# EAGLE design Adafruit Motor Shield v2 (EAGLE 6.3)
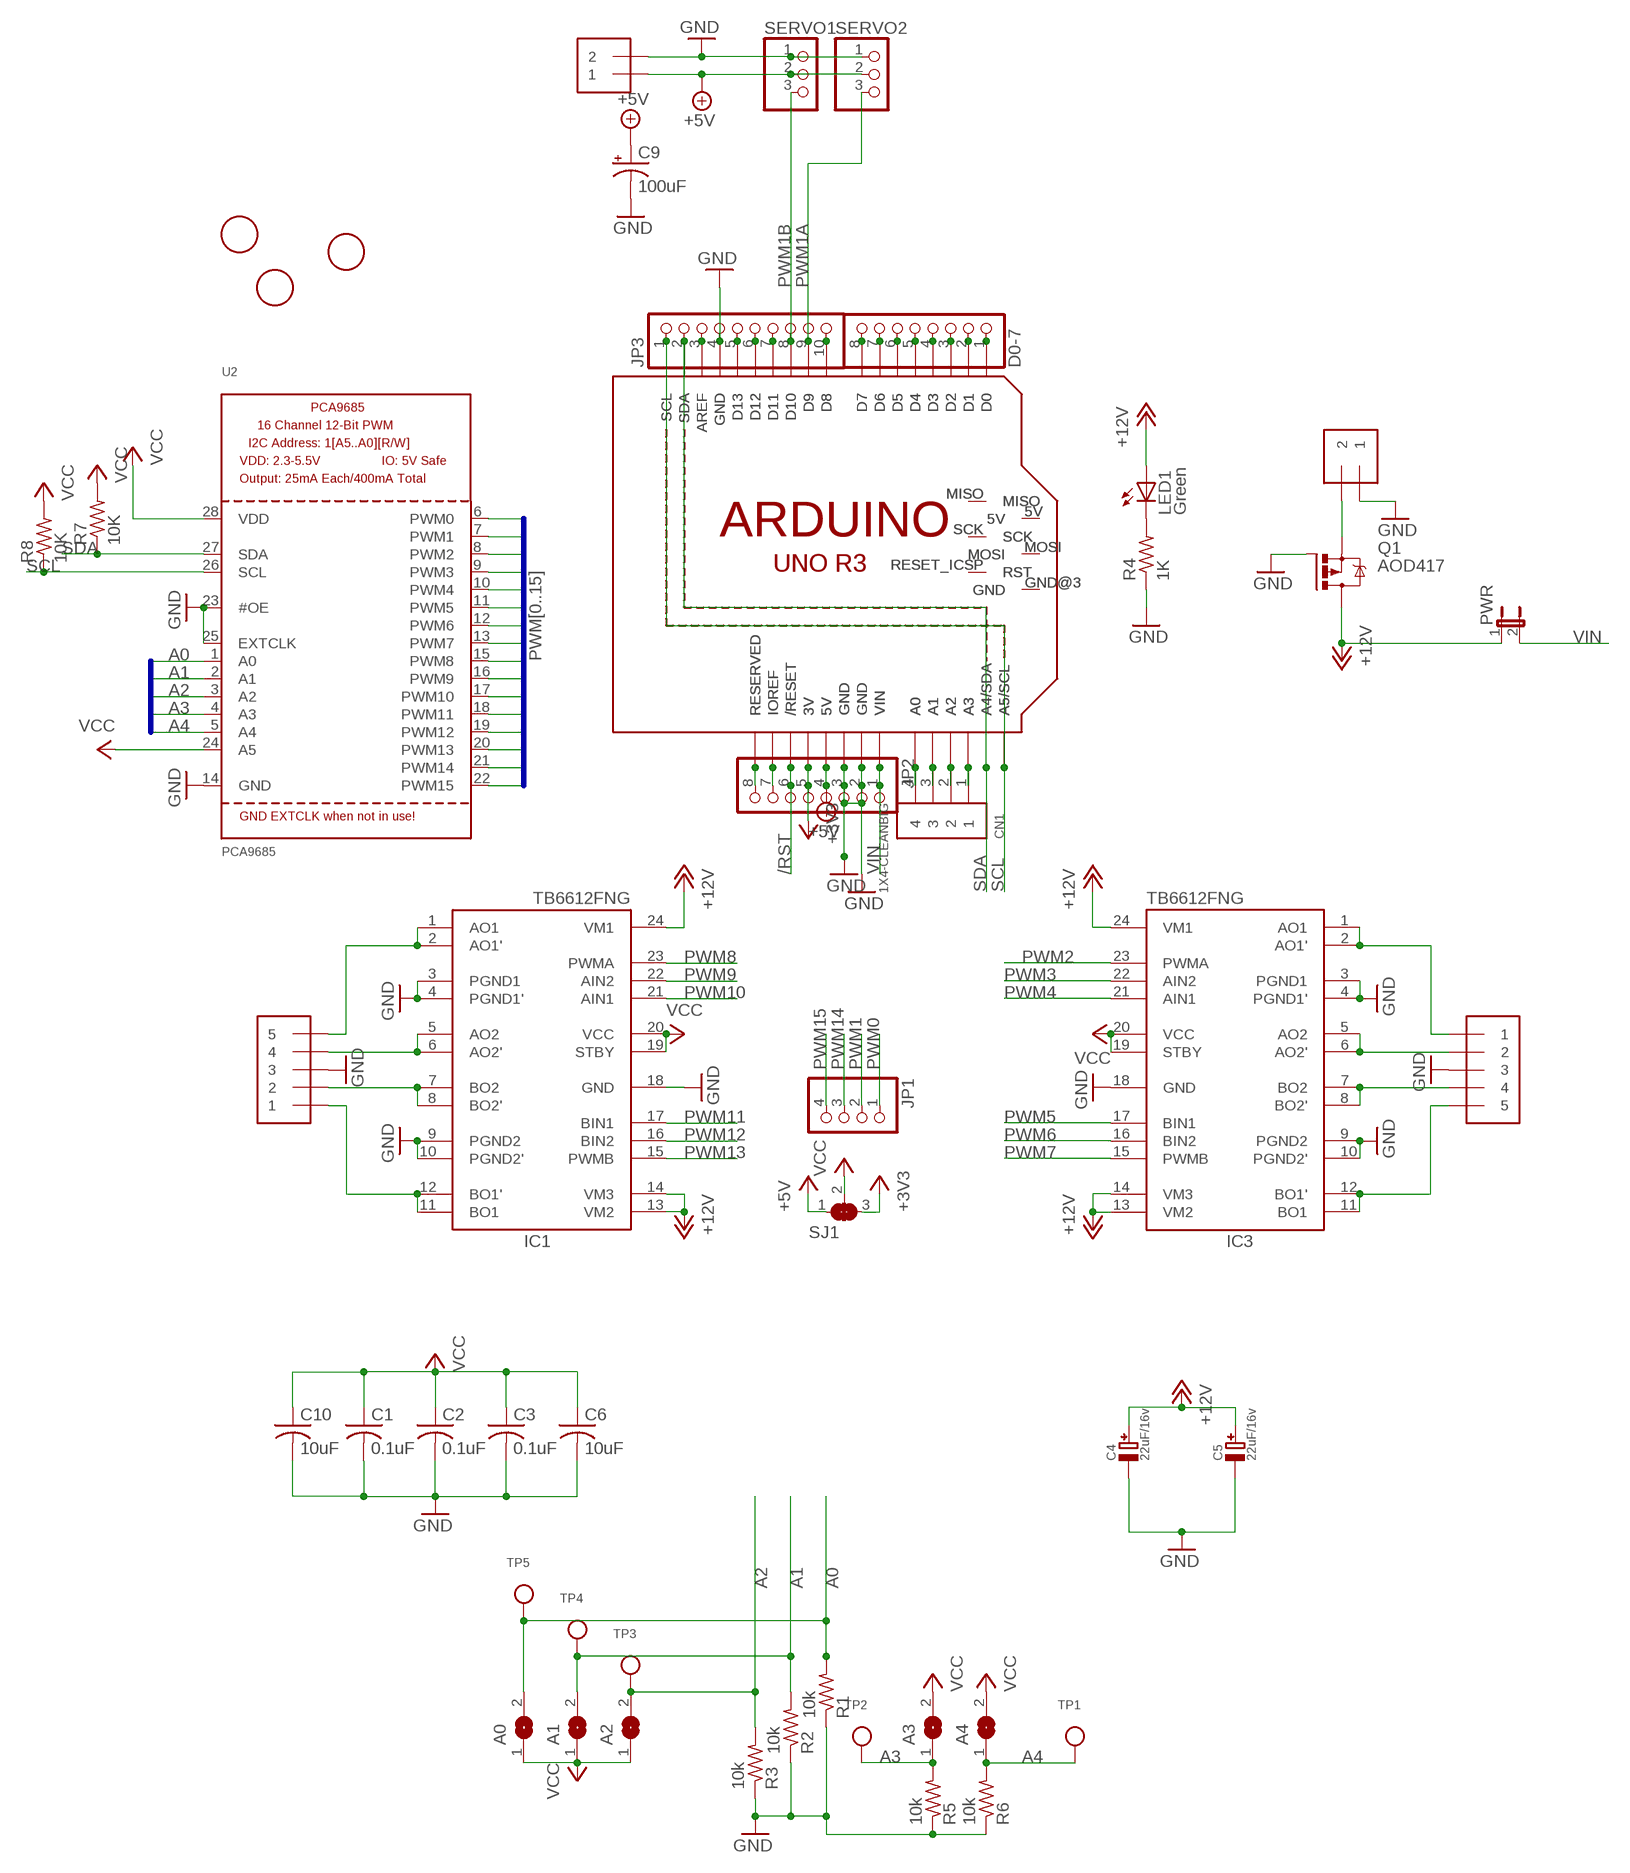
[diagram p0: schematic, sheet 1]

## Parts
A0  SJ  [SJ]
A1  SJ  [SJ]
A2  SJ  [SJ]
A3  SJ  [SJ]
A4  SJ  [SJ]
C1  0.1uF  C-USC0805K  [C0805K]
C2  0.1uF  C-USC0805K  [C0805K]
C3  0.1uF  C-USC0805K  [C0805K]
C4  22uF/16v  CAP_ELECTROLYTICPANASONIC_C  [PANASONIC_C]
C5  22uF/16v  CAP_ELECTROLYTICPANASONIC_C  [PANASONIC_C]
C6  10uF  C-USC0805K  [C0805K]
C9  100uF  CPOL-USC  [PANASONIC_C]
C10  10uF  C-USC0805K  [C0805K]
CN1  1X4-CLEANBIG  [1X04-CLEANBIG]
D0-7  PINHD-1X8CLEANBIG  [1X08-CLEANBIG]
IC1  TB6612FNG  [SSOP24]
IC3  TB6612FNG  [SSOP24]
J1  1X5  [1X05-3.5MM]
J2  1X5  [1X05-3.5MM]
JP1  HEADER-1X476MIL  [1X04_ROUND_76]
JP2  PINHD-1X8CLEANBIG  [1X08-CLEANBIG]
JP3  HEADER-1X1070MIL  [1X10_ROUND70]
LED1  Green  LEDCHIP-LED0805  [CHIP-LED0805]
MPOWER  1X2-3.5MM  [1X2-3.5MM]
PWR  JP1E  [JP1]
Q1  AOD417  IRFR5305  [D-PAK_TO252AA]
R1  10k  R-US_R0805  [R0805]
R2  10k  R-US_R0805  [R0805]
R3  10k  R-US_R0805  [R0805]
R4  1K  R-US_R0805  [R0805]
R5  10k  R-US_R0805  [R0805]
R6  10k  R-US_R0805  [R0805]
R7  10K  R-US_R0805  [R0805]
R8  10K  R-US_R0805  [R0805]
SERPWR  1X2-3.5MM  [1X2-3.5MM]
SERVO1  PINHD-1X3  [1X03]
SERVO2  PINHD-1X3  [1X03]
SJ1  SOLDERJUMPER_2WAY  [SOLDERJUMPER_2WAY_OPEN_NOPASTE]
TP1  TESTPOINTROUND2MM  [TESTPOINT_ROUND_2MM]
TP2  TESTPOINTROUND2MM  [TESTPOINT_ROUND_2MM]
TP3  TESTPOINTROUND2MM  [TESTPOINT_ROUND_2MM]
TP4  TESTPOINTROUND2MM  [TESTPOINT_ROUND_2MM]
TP5  TESTPOINTROUND2MM  [TESTPOINT_ROUND_2MM]
U2  PCA9685  [TSSOP28]
U$1  ARDUINO_R3_ICSP  [ARDUINOR3_ICSP]
U$2  FIDUCIAL  [FIDUCIAL_1MM]
U$3  FIDUCIAL  [FIDUCIAL_1MM]
U$4  FIDUCIAL  [FIDUCIAL_1MM]
U$5  ARDUINO_R3_ICSP  [ARDUINOR3_ICSP]

## Nets
+3V3: JP2.5 SJ1.3 U$1.3V U$5.3V
+5V: C9.+ JP2.4 SERPWR.1 SERVO1.2 SERVO2.2 SJ1.1 U$1.5V_ICSP(5V) U$5.5V_ICSP(5V)
+12V: C4.+ C5.+ IC1.13(VM2) IC1.14(VM3) IC1.24(VM1) IC3.13(VM2) IC3.14(VM3) IC3.24(VM1) LED1.A PWR.1 Q1.4(D)
/RST: JP2.6 U$1.RESET(/RESET) U$5.RESET(/RESET)
A0: A0.2 R1.2 TP5.P$1 U2.1(A0)
A1: A1.2 R2.2 TP4.P$1 U2.2(A1)
A2: A2.2 R3.2 TP3.P$1 U2.3(A2)
A3: A3.1 R5.2 TP2.P$1 U2.4(A3)
A4: A4.1 R6.2 TP1.P$1 U2.5(A4)
GND: C1.2 C2.2 C3.2 C4.- C5.- C6.2 C9.- C10.2 IC1.3(PGND1) IC1.4(PGND1') IC1.9(PGND2) IC1.10(PGND2') IC1.18(GND) IC3.3(PGND1) IC3.4(PGND1') IC3.9(PGND2) IC3.10(PGND2') IC3.18(GND) J1.3 J2.3 JP2.2 JP2.3 JP3.4 MPOWER.1 Q1.1(G) R1.1 R2.1 R3.1 R4.1 R5.1 R6.1 SERPWR.2 SERVO1.1 SERVO2.1 U2.14(GND) U2.23(#OE) U2.25(EXTCLK) U$1.GND U$1.GND@1(GND) U$1.GND@2(GND) U$5.GND U$5.GND@1(GND) U$5.GND@2(GND)
N$1: JP2.7 U$1.IOREF U$5.IOREF
N$2: JP2.8 U$1.RESERVED U$5.RESERVED
N$3: U$1.MISO U$5.MISO
N$4: IC1.1(AO1) IC1.2(AO1') J1.5
N$5: U$1.5V U$5.5V
N$6: IC1.5(AO2) IC1.6(AO2') J1.4
N$7: IC1.7(BO2) IC1.8(BO2') J1.2
N$8: U$1.MOSI U$5.MOSI
N$9: IC1.11(BO1) IC1.12(BO1') J1.1
N$10: U$1.GND@3(GND) U$5.GND@3(GND)
N$11: U$1.SCK U$5.SCK
N$12: IC3.1(AO1) IC3.2(AO1') J2.1
N$13: U$1.RESET_ICSP(RST) U$5.RESET_ICSP(RST)
N$14: IC3.5(AO2) IC3.6(AO2') J2.2
N$15: IC3.7(BO2) IC3.8(BO2') J2.4
N$17: IC3.11(BO1) IC3.12(BO1') J2.5
N$20: CN1.4 U$1.A0 U$5.A0
N$21: CN1.3 U$1.A1 U$5.A1
N$22: CN1.2 U$1.A2 U$5.A2
N$23: CN1.1 U$1.A3 U$5.A3
N$24: D0-7.1 U$1.D0 U$5.D0
N$25: D0-7.2 U$1.D1 U$5.D1
N$26: D0-7.3 U$1.D2 U$5.D2
N$27: D0-7.5 U$1.D4 U$5.D4
N$28: D0-7.8 U$1.D7 U$5.D7
N$29: JP3.10 U$1.D8 U$5.D8
N$30: JP3.6 U$1.D12 U$5.D12
N$31: JP3.5 U$1.D13 U$5.D13
N$32: JP3.3 U$1.AREF U$5.AREF
N$133: LED1.C R4.2
N$140: MPOWER.2 Q1.3(S)
PWM0: JP1.1 U2.6(PWM0)
PWM0A: D0-7.7 U$1.D6 U$5.D6
PWM0B: D0-7.6 U$1.D5 U$5.D5
PWM1: JP1.2 U2.7(PWM1)
PWM1A: JP3.9 SERVO2.3 U$1.D9 U$5.D9
PWM1B: JP3.8 SERVO1.3 U$1.D10 U$5.D10
PWM2: IC3.23(PWMA) U2.8(PWM2)
PWM2A: JP3.7 U$1.D11 U$5.D11
PWM2B: D0-7.4 U$1.D3 U$5.D3
PWM3: IC3.22(AIN2) U2.9(PWM3)
PWM4: IC3.21(AIN1) U2.10(PWM4)
PWM5: IC3.17(BIN1) U2.11(PWM5)
PWM6: IC3.16(BIN2) U2.12(PWM6)
PWM7: IC3.15(PWMB) U2.13(PWM7)
PWM8: IC1.23(PWMA) U2.15(PWM8)
PWM9: IC1.22(AIN2) U2.16(PWM9)
PWM10: IC1.21(AIN1) U2.17(PWM10)
PWM11: IC1.17(BIN1) U2.18(PWM11)
PWM12: IC1.16(BIN2) U2.19(PWM12)
PWM13: IC1.15(PWMB) U2.20(PWM13)
PWM14: JP1.3 U2.21(PWM14)
PWM15: JP1.4 U2.22(PWM15)
SCL: JP3.1 R8.1 U2.26(SCL) U$1.A5(A5/SCL) U$1.SCL U$5.A5(A5/SCL) U$5.SCL
SDA: JP3.2 R7.1 U2.27(SDA) U$1.A4(A4/SDA) U$1.SDA U$5.A4(A4/SDA) U$5.SDA
VCC: A0.1 A1.1 A2.1 A3.2 A4.2 C1.1 C2.1 C3.1 C6.1 C10.1 IC1.19(STBY) IC1.20(VCC) IC3.19(STBY) IC3.20(VCC) R7.2 R8.2 SJ1.2 U2.24(A5) U2.28(VDD)
VIN: JP2.1 PWR.2 U$1.VIN U$5.VIN

## Buses
PWM[0..15]
A[0..4]

## Library data of the parts
A0 A1-A4 = jumper:SJ: SMD solder JUMPER
C1-C3 C6 C10 = adafruit:C-US: CAPACITOR, American symbol
C4 C5 = microbuilder:CAP_ELECTROLYTIC: Electrolytic Capacitors SMT PANASONIC_C - Size C Panasonic Electrolytic Aluminum Capacitor 47µF 16V 20% Electrolytic Capacitor [Digikey: PCE3890TR-ND] PANASONIC_D - Size D Panasonic Electrolytic Aluminum Capacitor 100µF 25V 20% Electrolytic Capacitor [Digikey: PCE3898TR-ND] PTH 3.5 mm grid, 8 mm diameter ... 3.5 mm grid, 10 mm diameter ...
C9 = adafruit:CPOL-US: POLARIZED CAPACITOR, American symbol
CN1 = adafruit:1X4: 4-pin connector
D0-7 JP2 = adafruit:PINHD-1X8: PIN HEADER
IC1 IC3 = adafruit:TB6612FNG: TB6612FNG MOS dual H-bridge motor driver, 1.2A current 3.2A peak 3 or 5v logic and 3-15v motor
J1 J2 = adafruit:1X5
JP1 = microbuilder:HEADER-1X4: PIN HEADER
JP3 = microbuilder:HEADER-1X10: PIN HEADER
LED1 = adafruit:LED: LED OSRAM: - CHIPLED LG R971, LG N971, LY N971, LG Q971, LY Q971, LO R971, LY R971 LH N974, LH R974 LS Q976, LO Q976, LY Q976 LO Q996 - Hyper CHIPLED LW Q18S LB Q993, LB Q99A, LB R99A - SideLED LS A670, LO A670, LY A670, LG A670, LP A670 LB A673, LV A673, LT A673, LW A673 LH A674 LY A675 LS A676, LA A676, LO A676, LY A676, LW A676 LS A679, LY A679, LG A679 - Hyper Micro SIDELED® LS Y876, LA Y876, LO Y876, LY Y876 LT Y87S - SmartLED LW L88C, LW L88S LB L89C, LB L89S, LG L890 LS L89K, LO L89K, LY L89K LS L896, LA L896, LO L896, LY L896 - TOPLED LS T670, LO T670, LY T670, LG T670, LP T670 LSG T670, LSP T670, LSY T670, LOP T670, LYG T670 LG T671, LOG T671, LSG T671 LB T673, LV T673, LT T673, LW T673 LH T674 LS T676, LA T676, LO T676, LY T676, LB T676, LH T676, LSB T676, LW T676 LB T67C, LV T67C, LT T67C, LS T67K, LO T67K, LY T67K, LW E67C LS E67B, LA E67B, LO E67B, LY E67B, LB E67C, LV E67C, LT E67C LW T67C LS T679, LY T679, LG T679 LS T770, LO T770, LY T770, LG T770, LP T770 LB T773, LV T773, LT T773, LW T773 LH T774 LS E675, LA E675, LY E675, LS T675 LS T776, LA T776, LO T776, LY T776, LB T776 LHGB T686 LT T68C, LB T68C - Hyper Mini TOPLED® LB M676 - Mini TOPLED Santana® LG M470 LS M47K, LO M47K, LY M47K Source: http://www.osram.convergy.de/
MPOWER SERPWR = adafruit:1X2: 3.5mm Terminal block http://www.ladyada.net/library/pcb/eaglelibrary.html
PWR = jumper:JP1E: JUMPER
Q1 = transistor-power:IRF?5305: HEXFET Power MOSFET Source: http://www.irf.com/product-info/datasheets/data/irfr5305pbf.pdf
R1-R8 = adafruit:R-US_: RESISTOR, American symbol
SERVO1 SERVO2 = adafruit:PINHD-1X3: PIN HEADER
SJ1 = microbuilder:SOLDERJUMPER_2WAY: 2-Way Solder Jumper
TP1-TP5 = microbuilder:TESTPOINT: Test Point Various test points for characterisation and PCB testing TESTPOINT_SMT - Compact Surface Mount Test Point [Digikey: 5016KTR-ND]
U2 = microbuilder:PCA9685: PCA9685 - 16 Channel 12-Bit I2C PWM Controller 5.0V tolerant 16 channel, 12-bit I2C PWM controller with 25mA per output (max. 400mA total) Digikey: 568-5931-1-ND
U$1 U$5 = adafruit:ARDUINO_R3_ICSP
U$2-U$4 = adafruit:FIDUCIAL: For use by pick and place machines to calibrate the vision/machine, 1mm By microbuilder.eu

## Board
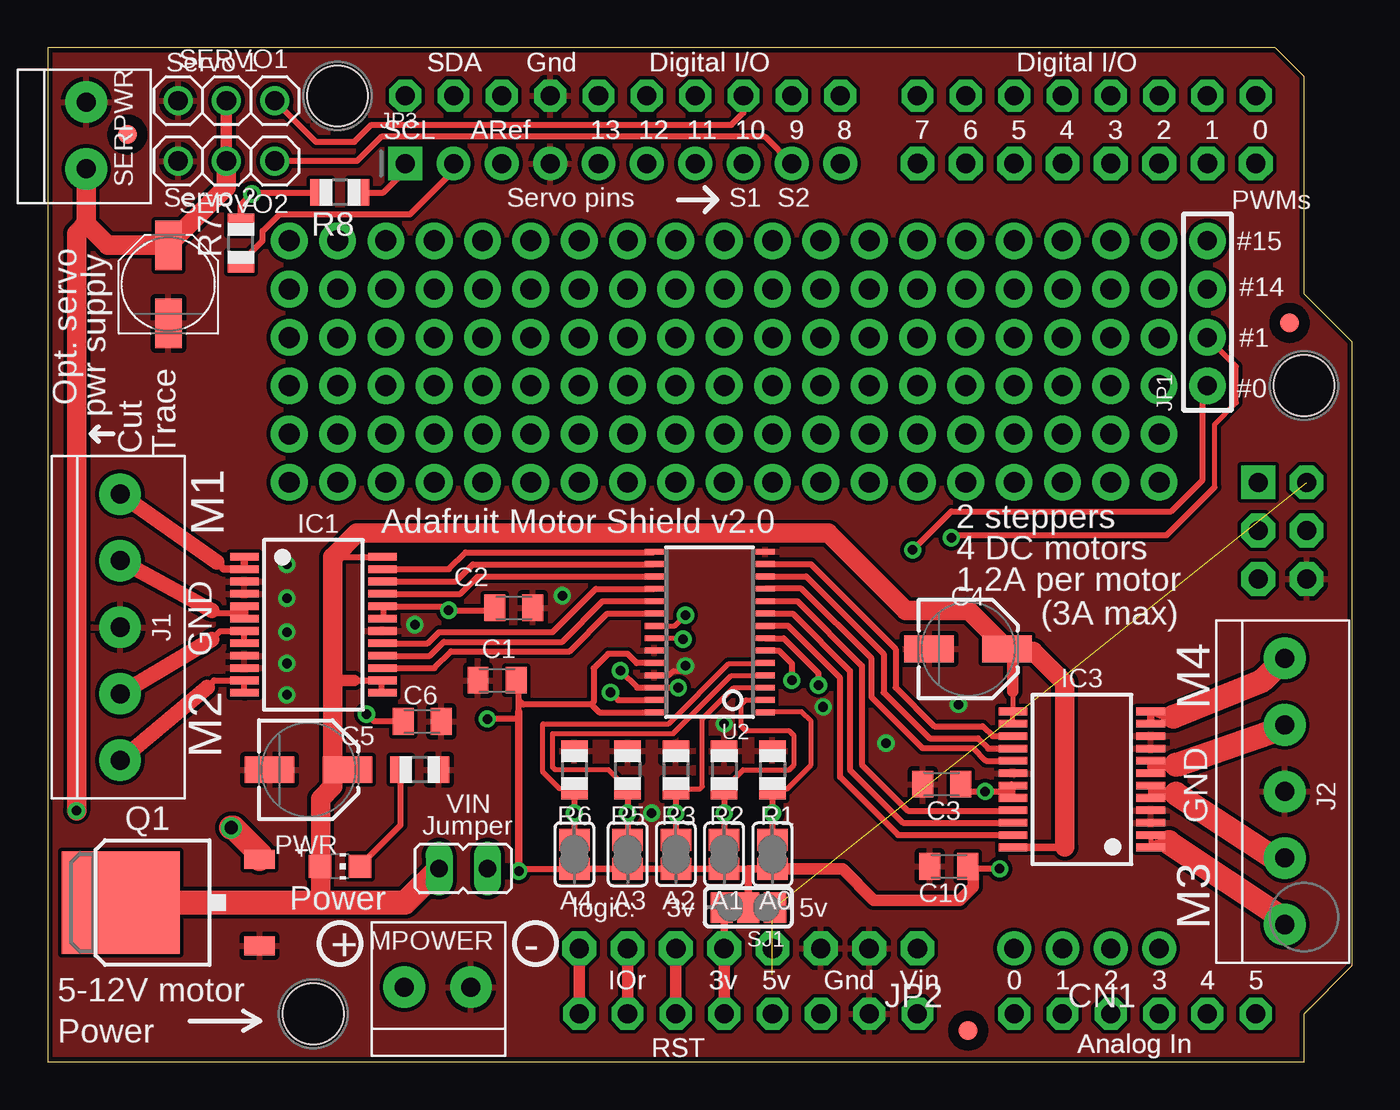
[diagram p1: board, top side]
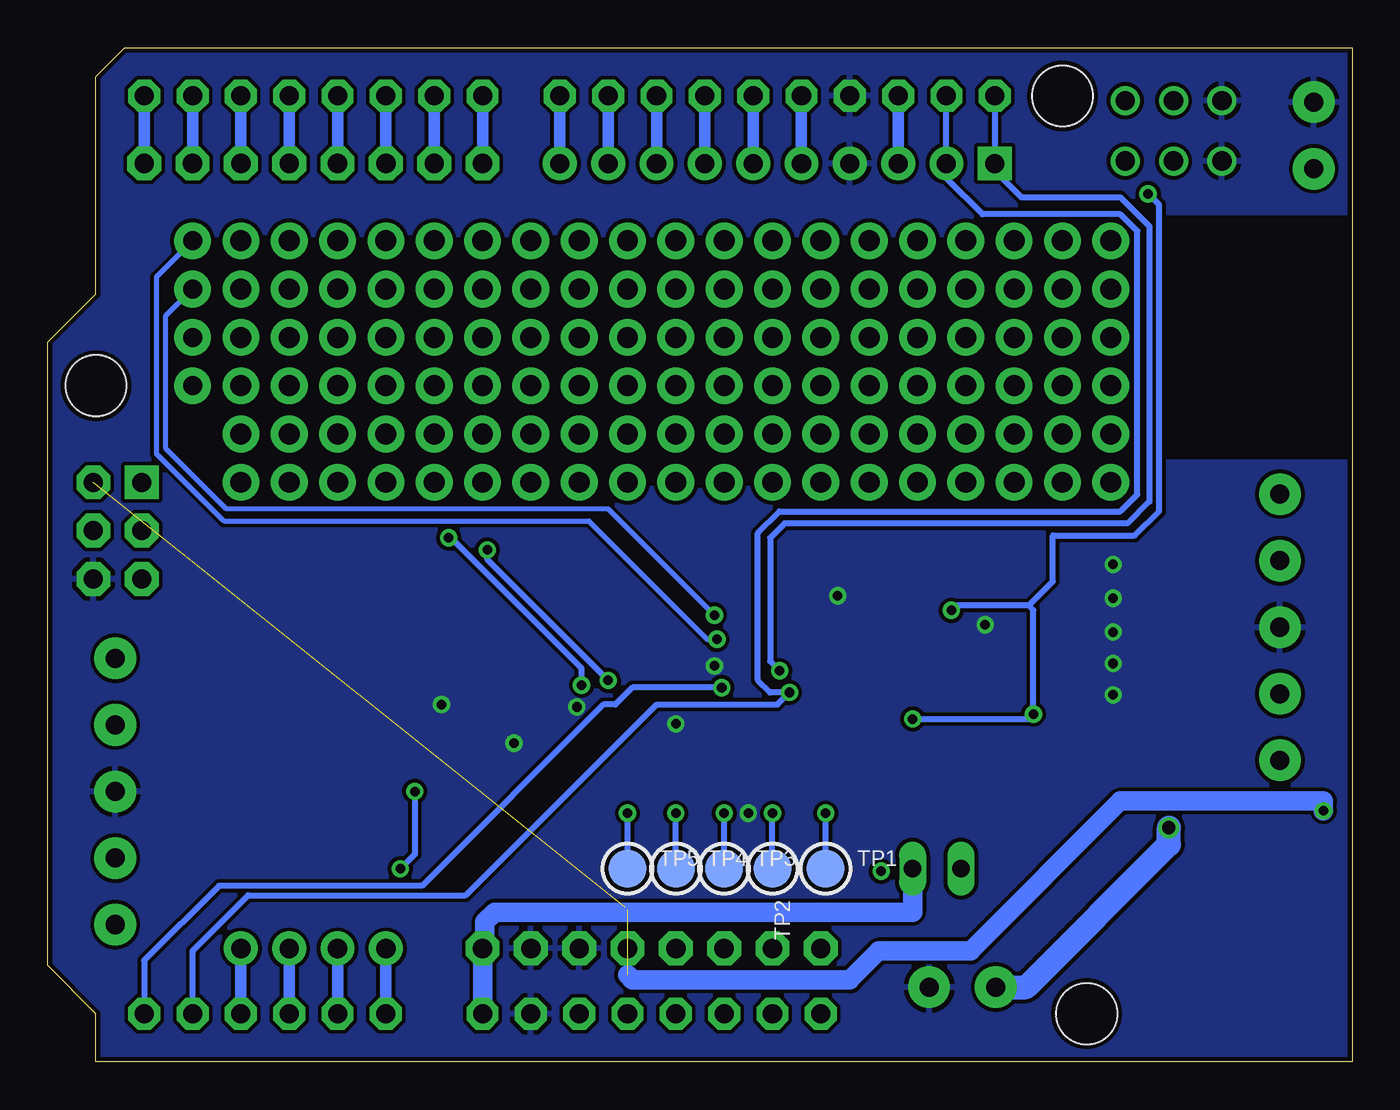
[diagram p2: board, bottom side, seen from below]

Size 68.58 x 53.34 mm. Coordinates in mm from the lower left corner, seen from the top.
Copper layers (1*16): Top 0.035mm / dielectric 1.5mm / Bottom 0.035mm
Design rules "pcbcart *": minimum track width 10mil, minimum drill 16mil, track to track 8mil, track to pad 8mil, pad to pad 8mil, via to via 8mil, smd to smd 8mil, copper to edge 10mil, drill to drill 8mil, minimum pad ring 10mil, minimum via ring 8mil, stop-mask expansion 4mil, vias tented up to drill 20mil, thermal gap 10mil
Holes 3.2 mm at 15.24,50.8 66.04,35.56 13.97,2.54

### Footprints (pad centres in the part's own frame; a part is rotated, then mirrored left to right if it is on the bottom)
SJ = smd 1.168 x 1.6: 1 -0.762,0; 2 0.762,0
C0805K = smd 1.1 x 1.4: 1 -1,0; 2 1,0
PANASONIC_C = smd 2.6 x 1.4: + 2.05,0; - -2.05,0
1X04-CLEANBIG = drill 1.016 pad 1.778: 1 -3.81,0; 2 -1.27,0; 3 1.27,0; 4 3.81,0
1X08-CLEANBIG = drill 1.016 pad 1.778 octagon: 1 -8.89,0; 2 -6.35,0; 3 -3.81,0; 4 -1.27,0; 5 1.27,0; 6 3.81,0; 7 6.35,0; 8 8.89,0
SSOP24 = smd 0.4 x 1.5: 1 -3.575,-3.625; 2 -2.925,-3.625; 3 -2.275,-3.625; 4 -1.625,-3.625; 5 -0.975,-3.625; 6 -0.325,-3.625; 7 0.325,-3.625; 8 0.975,-3.625; 9 1.625,-3.625; 10 2.275,-3.625; 11 2.925,-3.625; 12 3.575,-3.625; 13 3.575,3.625; 14 2.925,3.625; 15 2.275,3.625; 16 1.625,3.625; 17 0.975,3.625; 18 0.325,3.625; 19 -0.325,3.625; 20 -0.975,3.625; 21 -1.625,3.625; 22 -2.275,3.625; 23 -2.925,3.625; 24 -3.575,3.625
1X05-3.5MM = drill 1 pad 2.184: 1 7,0; 2 3.5,0; 3 0,0; 4 -3.5,0; 5 -7,0
1X04_ROUND_76 = drill 1 pad 1.93: 1 -3.81,0; 2 -1.27,0; 3 1.27,0; 4 3.81,0
1X10_ROUND70 = drill 1 pad 1.778 square: 1 -11.43,0 | drill 1 pad 1.778: 2 -8.89,0; 3 -6.35,0; 4 -3.81,0; 5 -1.27,0; 6 1.27,0; 7 3.81,0; 8 6.35,0; 9 8.89,0; 10 11.43,0
CHIP-LED0805 = smd 1.2 x 1.2: A 0,-1.05; C 0,1.05
1X2-3.5MM = drill 1 pad 2.184: 1 1.8,0; 2 -1.7,0
JP1 = drill 0.914 long: 1 0,-1.27; 2 0,1.27
D-PAK_TO252AA = smd 1 x 1.6: 1 -2.28,-4.8; 3 2.28,-4.8 | smd 5.4 x 6.2: 4 0,2.5
R0805 = smd 1.1 x 1.4: 1 -1,0; 2 1,0
1X03 = drill 1.016: 1 -2.54,0; 2 0,0; 3 2.54,0
SOLDERJUMPER_2WAY_OPEN_NOPASTE = smd 1.168 x 1.6: 1 -1.397,0; 2 0,0; 3 1.397,0
TESTPOINT_ROUND_2MM = smd 2 x 2: P$1 0,0
TSSOP28 = smd 0.305 x 0.991: 1 -4.225,-2.918; 2 -3.575,-2.918; 3 -2.925,-2.918; 4 -2.275,-2.918; 5 -1.625,-2.918; 6 -0.975,-2.918; 7 -0.325,-2.918; 8 0.325,-2.918; 9 0.975,-2.918; 10 1.625,-2.918; 11 2.275,-2.918; 12 2.925,-2.918; 13 3.575,-2.918; 14 4.225,-2.918; 15 4.225,2.918; 16 3.575,2.918; 17 2.925,2.918; 18 2.275,2.918; 19 1.625,2.918; 20 0.975,2.918; 21 0.325,2.918; 22 -0.325,2.918; 23 -0.975,2.918; 24 -1.625,2.918; 25 -2.275,2.918; 26 -2.925,2.918; 27 -3.575,2.918; 28 -4.225,2.918
ARDUINOR3_ICSP = drill 1 pad 1.676 octagon: 3V 35.56,2.54; 5V 38.1,2.54; A0 50.8,2.54; A1 53.34,2.54; A2 55.88,2.54; A3 58.42,2.54; A4 60.96,2.54; A5 63.5,2.54; AREF 23.876,50.8; D0 63.5,50.8; D1 60.96,50.8; D2 58.42,50.8; D3 55.88,50.8; D4 53.34,50.8; D5 50.8,50.8; D6 48.26,50.8; D7 45.72,50.8; D8 41.656,50.8; D9 39.116,50.8; D10 36.576,50.8; D11 34.036,50.8; D12 31.496,50.8; D13 28.956,50.8; GND 26.416,50.8; GND@2 43.18,2.54; GND@3 40.64,2.54; IOREF 30.48,2.54; RESERVED 27.94,2.54; RESET 33.02,2.54; SCL 18.796,50.8; SDA 21.336,50.8; VIN 45.72,2.54 | drill 1 pad 1.778 octagon: 5V_ICSP 66.167,30.48; GND@1 66.167,25.4; MOSI 66.167,27.94; RESET_ICSP 63.627,25.4; SCK 63.627,27.94 | drill 1 pad 1.778 square: MISO 63.627,30.48
FIDUCIAL_1MM = smd 1 x 1: 1 0,0

### Placement (x,y rotation side)
A0  38.1,10.92 90 top
A1  35.56,10.92 90 top
A2  33.02,10.92 90 top
A3  30.48,10.92 270 top
A4  27.69,10.92 270 top
C1  23.62,20.07 180 top
C2  24.51,23.88 0 top
C3  46.99,14.61 180 top
C4  48.39,21.72 0 top
C5  13.72,15.37 0 top
C6  19.68,17.91 0 top
C9  6.35,40.89 90 top
C10  47.37,10.29 180 top
CN1  54.61,5.97 180 top
D0-7  54.61,47.24 180 top
IC1  13.97,22.99 270 top
IC3  54.36,14.86 90 top
J1  3.81,22.86 270 top
J2  65.02,14.22 270 top
JP1  60.96,39.37 90 top
JP2  36.83,5.97 180 top
JP3  30.23,47.24 0 top
LED1  15.37,10.29 270 top
MPOWER  20.45,3.94 0 top
PWR  21.84,10.16 270 top
Q1  6.35,8.38 90 top
R1  38.1,15.37 270 top
R2  35.56,15.37 270 top
R3  33.02,15.37 270 top
R4  19.56,15.37 180 top
R5  30.48,15.37 270 top
R6  27.69,15.37 270 top
R7  10.16,43.05 90 top
R8  15.37,45.72 180 top
SERPWR  2.03,48.77 270 top
SERVO1  9.4,50.55 0 top
SERVO2  9.4,47.37 0 top
SJ1  36.83,8.13 180 top
TP1  27.69,10.16 0 bottom
TP2  30.48,10.16 270 bottom
TP3  33.02,10.16 0 bottom
TP4  35.56,10.16 0 bottom
TP5  38.1,10.16 0 bottom
U2  34.8,22.61 90 top
U$1  0,0 0 top
U$2  48.39,1.65 0 top
U$3  4.19,48.77 0 top
U$4  65.28,38.86 0 top
U$5  0,0 0 top

### Tracks (layer width: path | path; a pad name or v marks a point on that pad's centre or on a via)
+3V3
  Top 0.406: JP2.5 35.56,8 SJ1.3
  Top 0.61: U$5.3V JP2.5
+5V  (via drill 0.5)  (3 unrouted)
  Top 0.254: SJ1.1 36.7,8.13
  Top 0.406: 38.1,8 SJ1.1
  Top 0.61: SERVO2.2 SERVO1.2
  Top 1.016: SERVO2.2 9.4,45.99 C9.+ 3.16,42.94 2.03,44.07 | 2.03,44.07 SERPWR.1 | 2.03,44.07 1.52,43.56 v1.52,13.21
  Bottom 1.016: v1.52,13.21 1.52,13.72 12.19,13.72 20.07,5.84 24.89,5.84 26.42,4.32 37.85,4.32 38.1,4.57
+12V
  Top 0.254: 50.73,19.49 IC3.13 IC3.14
  Top 0.305: 16.13,20.07 IC1.14 17.53,19.99 17.53,19.43 17.58,19.43 IC1.13 | 14.99,15.88 14.73,15.62 14.99,15.37 C5.+ | 14.99,26.54 15.01,26.56 IC1.24 | 53.47,11.3 53.45,11.28 53.32,11.28
  Top 0.406: IC3.24 53.32,11.28
  Top 0.61: 14.99,20.07 16.13,20.07 | 50.73,19.49 50.73,21.42 C4.+
  Top 1.016: 14.99,26.54 14.99,20.07 14.99,15.88 14.99,14.48 14.35,13.84 14.35,10.29 LED1.A 14.35,10.25 14.35,8.38 | 15.01,26.56 16.26,27.81 41.04,27.81 45.1,23.75 48.41,23.75 C4.+ 50.56,21.59 51.82,21.59 53.47,19.94 53.47,11.3
  Top 1.27: Q1.4 14.35,8.38 18.8,8.38 PWR.1
/RST
  Top 0.61: JP2.6 U$5.RESET
A0  (via drill 0.5)
  Top 0.254: R1.2 38.88,14.37 40.13,15.62 40.13,17.91 39.62,18.41 37.75,18.41 U2.1
  Top 0.305: R1.2 v38.1,13.08 A0.2
  Bottom 0.305: TP5.P$1 v38.1,13.08
A1  (via drill 0.5)
  Top 0.254: R2.2 36.56,15.37 38.99,15.37 39.24,15.62 39.24,17.14 38.99,17.4 36.7,17.4 36.45,17.65 36.45,18.8 36.7,19.05 37.7,19.05 U2.2
  Top 0.305: R2.2 v35.56,13.08 A1.2
  Bottom 0.305: TP4.P$1 v35.56,13.08
A2  (via drill 0.5)
  Top 0.254: R3.2 34.31,14.37 34.42,14.48 34.42,18.03 36.06,19.68 U2.3
  Top 0.305: R3.2 v33.02,13.08 A2.2
  Bottom 0.305: TP3.P$1 v33.02,13.08
A3  (via drill 0.5)
  Top 0.254: R5.2 29.48,15.37 26.67,15.37 26.54,15.49 26.54,17.27 32.89,17.27 35.94,20.32 37.7,20.32 U2.4
  Top 0.305: R5.2 v30.48,13.08 A3.1
  Bottom 0.305: TP2.P$1 v30.48,13.08
A4  (via drill 0.5)
  Top 0.254: R6.2 26.91,14.37 26.04,15.24 26.04,17.78 32.64,17.78 35.81,20.95 37.69,20.95 U2.5
  Top 0.305: R6.2 v27.69,13.08 A4.1
  Bottom 0.305: TP1.P$1 v27.69,13.08
GND  (via drill 0.5)
  Top 0.254: U2.25 32.65,20.33 32.89,20.57 33.27,20.57 v33.53,20.83
  other vias: 19.3,22.99 12.57,24.38 12.57,22.61 12.57,20.95 12.57,19.3 12.57,26.16 27.05,24.51 35.56,17.78 31.75,13.08 47.88,18.8 44.07,16.76 40.77,18.67
  pour Bottom: 0,0.13 0,53.72 71.25,53.59 71.25,0
  pour Top: 0,0.13 0,53.72 70.74,53.72 70.74,0.13
N$1
  Top 0.61: U$5.IOREF JP2.7
N$2
  Top 0.61: U$5.RESERVED JP2.8
N$4
  Top 0.305: 10.41,25.91 IC1.2
  Top 0.406: 10.41,26.56 IC1.1 IC1.2 9.27,25.91 8.89,26.29
  Top 0.813: J1.5 8.89,26.29
N$6
  Top 0.305: 8.64,23.75 8.76,23.62 10.29,23.62 10.29,23.37 IC1.6 10.4,23.37 10.41,23.37 10.41,23.88 10.41,23.89 IC1.5
  Top 0.813: J1.4 8.64,23.75
N$7
  Top 0.305: IC1.8 10.29,22.07 10.35,22.13 IC1.7 9.07,22.66 8.64,22.23
  Top 0.813: J1.2 8.64,22.23
N$9
  Top 0.305: 8.38,19.68 8.76,20.06 IC1.11 10.35,19.5 10.41,19.43
  Top 0.406: 10.41,19.43 10.39,19.41 IC1.12
  Top 0.813: J1.1 8.38,19.68
N$12
  Top 0.254: IC3.2 IC3.1 58.25,11.56 58.93,11.56
  Top 1.27: 58.93,11.56 65.02,7.49 J2.1
N$14
  Top 0.254: IC3.5 IC3.6
  Top 0.406: IC3.5 58.32,14.22 58.93,14.22 59.31,14.1
  Top 1.27: 59.31,14.1 64.46,10.72 J2.2
N$15
  Top 0.305: IC3.7 IC3.8 57.94,15.49 59.31,15.62
  Top 1.27: 59.31,15.62 64.83,17.53 J2.4
N$17
  Top 0.406: IC3.11 IC3.12 58.63,18.16 59.18,18.16
  Top 1.27: 59.18,18.16 63.87,20.07 J2.5
N$20
  Bottom 0.61: CN1.4 U$5.A0
N$21
  Bottom 0.61: CN1.3 U$5.A1
N$22
  Bottom 0.61: CN1.2 U$5.A2
N$23
  Bottom 0.61: CN1.1 U$5.A3
N$24
  Bottom 0.61: U$5.D0 D0-7.1
N$25
  Bottom 0.61: U$5.D1 D0-7.2
N$26
  Bottom 0.61: U$5.D2 D0-7.3
N$27
  Bottom 0.61: U$5.D4 D0-7.5
N$28
  Bottom 0.61: U$5.D7 D0-7.8
N$29
  Bottom 0.61: U$5.D8 JP3.10
N$30
  Bottom 0.61: JP3.6 U$5.D12
N$31
  Bottom 0.61: JP3.5 U$5.D13
N$32
  Bottom 0.61: U$5.AREF JP3.3
N$34  (via drill 1.1 pad 1.93)
  other vias: 12.7,33.02
N$35  (via drill 1.1 pad 1.93)
  other vias: 15.24,33.02
N$36  (via drill 1.1 pad 1.93)
  other vias: 15.24,35.56
N$37  (via drill 1.1 pad 1.93)
  other vias: 15.24,38.1
N$38  (via drill 1.1 pad 1.93)
  other vias: 12.7,38.1
N$39  (via drill 1.1 pad 1.93)
  other vias: 12.7,40.64
N$40  (via drill 1.1 pad 1.93)
  other vias: 15.24,40.64
N$41  (via drill 1.1 pad 1.93)
  other vias: 15.24,43.18
N$42  (via drill 1.1 pad 1.93)
  other vias: 12.7,43.18
N$43  (via drill 1.1 pad 1.93)
  other vias: 17.78,43.18
N$44  (via drill 1.1 pad 1.93)
  other vias: 12.7,35.56
N$45  (via drill 1.1 pad 1.93)
  other vias: 17.78,40.64
N$46  (via drill 1.1 pad 1.93)
  other vias: 17.78,38.1
N$47  (via drill 1.1 pad 1.93)
  other vias: 17.78,35.56
N$48  (via drill 1.1 pad 1.93)
  other vias: 17.78,33.02
N$49  (via drill 1.1 pad 1.93)
  other vias: 20.32,33.02
N$50  (via drill 1.1 pad 1.93)
  other vias: 20.32,35.56
N$51  (via drill 1.1 pad 1.93)
  other vias: 20.32,38.1
N$52  (via drill 1.1 pad 1.93)
  other vias: 20.32,40.64
N$53  (via drill 1.1 pad 1.93)
  other vias: 20.32,43.18
N$54  (via drill 1.1 pad 1.93)
  other vias: 22.86,43.18
N$55  (via drill 1.1 pad 1.93)
  other vias: 22.86,40.64
N$56  (via drill 1.1 pad 1.93)
  other vias: 22.86,38.1
N$57  (via drill 1.1 pad 1.93)
  other vias: 22.86,35.56
N$58  (via drill 1.1 pad 1.93)
  other vias: 22.86,33.02
N$59  (via drill 1.1 pad 1.93)
  other vias: 25.4,33.02
N$60  (via drill 1.1 pad 1.93)
  other vias: 25.4,35.56
N$61  (via drill 1.1 pad 1.93)
  other vias: 25.4,38.1
N$62  (via drill 1.1 pad 1.93)
  other vias: 25.4,40.64
N$63  (via drill 1.1 pad 1.93)
  other vias: 25.4,43.18
N$64  (via drill 1.1 pad 1.93)
  other vias: 27.94,43.18
N$65  (via drill 1.1 pad 1.93)
  other vias: 27.94,40.64
N$66  (via drill 1.1 pad 1.93)
  other vias: 27.94,38.1
N$67  (via drill 1.1 pad 1.93)
  other vias: 27.94,35.56
N$68  (via drill 1.1 pad 1.93)
  other vias: 27.94,33.02
N$69  (via drill 1.1 pad 1.93)
  other vias: 30.48,33.02
N$70  (via drill 1.1 pad 1.93)
  other vias: 30.48,35.56
N$71  (via drill 1.1 pad 1.93)
  other vias: 30.48,38.1
N$72  (via drill 1.1 pad 1.93)
  other vias: 30.48,40.64
N$73  (via drill 1.1 pad 1.93)
  other vias: 30.48,43.18
N$74  (via drill 1.1 pad 1.93)
  other vias: 33.02,43.18
N$75  (via drill 1.1 pad 1.93)
  other vias: 35.56,43.18
N$76  (via drill 1.1 pad 1.93)
  other vias: 38.1,43.18
N$77  (via drill 1.1 pad 1.93)
  other vias: 40.64,43.18
N$78  (via drill 1.1 pad 1.93)
  other vias: 43.18,43.18
N$79  (via drill 1.1 pad 1.93)
  other vias: 45.72,43.18
N$80  (via drill 1.1 pad 1.93)
  other vias: 48.26,43.18
N$81  (via drill 1.1 pad 1.93)
  other vias: 50.8,40.64
N$82  (via drill 1.1 pad 1.93)
  other vias: 53.34,40.64
N$83  (via drill 1.1 pad 1.93)
  other vias: 55.88,40.64
N$84  (via drill 1.1 pad 1.93)
  other vias: 58.42,40.64
N$89  (via drill 1.1 pad 1.93)
  other vias: 58.42,33.02
N$90  (via drill 1.1 pad 1.93)
  other vias: 58.42,35.56
N$91  (via drill 1.1 pad 1.93)
  other vias: 58.42,38.1
N$92  (via drill 1.1 pad 1.93)
  other vias: 55.88,38.1
N$93  (via drill 1.1 pad 1.93)
  other vias: 55.88,35.56
N$94  (via drill 1.1 pad 1.93)
  other vias: 55.88,33.02
N$95  (via drill 1.1 pad 1.93)
  other vias: 53.34,33.02
N$96  (via drill 1.1 pad 1.93)
  other vias: 53.34,35.56
N$97  (via drill 1.1 pad 1.93)
  other vias: 53.34,38.1
N$98  (via drill 1.1 pad 1.93)
  other vias: 50.8,38.1
N$99  (via drill 1.1 pad 1.93)
  other vias: 50.8,35.56
N$100  (via drill 1.1 pad 1.93)
  other vias: 50.8,33.02
N$101  (via drill 1.1 pad 1.93)
  other vias: 48.26,33.02
N$102  (via drill 1.1 pad 1.93)
  other vias: 48.26,35.56
N$103  (via drill 1.1 pad 1.93)
  other vias: 48.26,38.1
N$104  (via drill 1.1 pad 1.93)
  other vias: 48.26,40.64
N$105  (via drill 1.1 pad 1.93)
  other vias: 45.72,40.64
N$106  (via drill 1.1 pad 1.93)
  other vias: 45.72,38.1
N$107  (via drill 1.1 pad 1.93)
  other vias: 45.72,35.56
N$108  (via drill 1.1 pad 1.93)
  other vias: 45.72,33.02
N$109  (via drill 1.1 pad 1.93)
  other vias: 43.18,33.02
N$110  (via drill 1.1 pad 1.93)
  other vias: 43.18,35.56
N$111  (via drill 1.1 pad 1.93)
  other vias: 43.18,38.1
N$112  (via drill 1.1 pad 1.93)
  other vias: 43.18,40.64
N$113  (via drill 1.1 pad 1.93)
  other vias: 40.64,40.64
N$114  (via drill 1.1 pad 1.93)
  other vias: 40.64,38.1
N$115  (via drill 1.1 pad 1.93)
  other vias: 40.64,35.56
N$116  (via drill 1.1 pad 1.93)
  other vias: 40.64,33.02
N$117  (via drill 1.1 pad 1.93)
  other vias: 38.1,33.02
N$118  (via drill 1.1 pad 1.93)
  other vias: 38.1,35.56
N$119  (via drill 1.1 pad 1.93)
  other vias: 38.1,38.1
N$120  (via drill 1.1 pad 1.93)
  other vias: 38.1,40.64
N$121  (via drill 1.1 pad 1.93)
  other vias: 35.56,40.64
N$122  (via drill 1.1 pad 1.93)
  other vias: 35.56,38.1
N$123  (via drill 1.1 pad 1.93)
  other vias: 35.56,35.56
N$124  (via drill 1.1 pad 1.93)
  other vias: 35.56,33.02
N$125  (via drill 1.1 pad 1.93)
  other vias: 33.02,33.02
N$126  (via drill 1.1 pad 1.93)
  other vias: 33.02,35.56
N$127  (via drill 1.1 pad 1.93)
  other vias: 33.02,38.1
N$128  (via drill 1.1 pad 1.93)
  other vias: 33.02,40.64
N$133
  Top 0.305: LED1.C 16.38,10.29 18.56,12.46 R4.2
N$135  (via drill 1.1 pad 1.93)
  other vias: 50.8,43.18
N$136  (via drill 1.1 pad 1.93)
  other vias: 53.34,43.18
N$137  (via drill 1.1 pad 1.93)
  other vias: 55.88,43.18
N$138  (via drill 1.1 pad 1.93)
  other vias: 58.42,43.18
N$140  (via drill 0.7)
  Top 1.27: Q1.3 11.15,10.9 11.18,10.92 9.78,12.32 v9.65,12.32
  Bottom 1.27: MPOWER.2 17.14,3.94 9.65,11.43 v9.65,12.32
N$141  (via drill 1.1 pad 1.93)
  other vias: 12.7,30.48
N$142  (via drill 1.1 pad 1.93)
  other vias: 15.24,30.48
N$143  (via drill 1.1 pad 1.93)
  other vias: 17.78,30.48
N$144  (via drill 1.1 pad 1.93)
  other vias: 22.86,30.48
N$145  (via drill 1.1 pad 1.93)
  other vias: 20.32,30.48
N$146  (via drill 1.1 pad 1.93)
  other vias: 25.4,30.48
N$147  (via drill 1.1 pad 1.93)
  other vias: 27.94,30.48
N$148  (via drill 1.1 pad 1.93)
  other vias: 30.48,30.48
N$149  (via drill 1.1 pad 1.93)
  other vias: 33.02,30.48
N$150  (via drill 1.1 pad 1.93)
  other vias: 35.56,30.48
N$151  (via drill 1.1 pad 1.93)
  other vias: 38.1,30.48
N$152  (via drill 1.1 pad 1.93)
  other vias: 40.64,30.48
N$153  (via drill 1.1 pad 1.93)
  other vias: 43.18,30.48
N$154  (via drill 1.1 pad 1.93)
  other vias: 45.72,30.48
N$155  (via drill 1.1 pad 1.93)
  other vias: 48.26,30.48
N$156  (via drill 1.1 pad 1.93)
  other vias: 50.8,30.48
N$157  (via drill 1.1 pad 1.93)
  other vias: 53.34,30.48
N$158  (via drill 1.1 pad 1.93)
  other vias: 55.88,30.48
N$159  (via drill 1.1 pad 1.93)
  other vias: 58.42,30.48
PWM0  (via drill 0.5)
  Top 0.305: JP1.1 60.71,35.31 60.71,30.61 59.05,28.96 47.5,28.96 v45.47,26.92 | U2.6 38.44,21.63 39.12,20.95 v39.12,20.07
  Bottom 0.305: v39.12,20.07 45.47,26.42 v45.47,26.92
PWM0A
  Bottom 0.61: U$5.D6 D0-7.7
PWM0B
  Bottom 0.305: 50.8,48.13 50.93,48.01 50.93,47.37 D0-7.6
  Bottom 0.61: U$5.D5 50.8,48.13
PWM1  (via drill 0.5)
  Top 0.254: 61.34,30.23 61.34,33.53 62.48,34.67 62.48,36.58 JP1.2
  Top 0.305: U2.7 38.68,22.28 40.51,20.45 v40.51,19.81 | 61.34,30.23 58.8,27.69 47.62,27.69 v47.5,27.56
  Bottom 0.305: v40.51,19.81 40.51,20.7 47.37,27.56 v47.5,27.56
PWM1A
  Top 0.305: JP3.9 37.72,48.64 17.53,48.64 16.26,47.37 SERVO2.3
  Bottom 0.61: JP3.9 U$5.D9
PWM1B
  Top 0.305: SERVO1.3 14.1,48.39 16.13,48.39 17.02,49.28 35.94,49.28 36.58,49.91 U$5.D10
  Bottom 0.61: JP3.8 U$5.D10
PWM2
  Top 0.305: U2.8 38.92,22.93 41.66,20.19 41.66,14.99 44.7,11.94 IC3.23
PWM2A
  Bottom 0.61: JP3.7 U$5.D11
PWM2B
  Bottom 0.61: U$5.D3 D0-7.4
PWM3
  Top 0.305: U2.9 39.16,23.58 42.16,20.57 42.16,15.37 44.95,12.58 IC3.22
PWM4
  Top 0.305: U2.10 39.4,24.23 42.8,20.83 42.8,15.62 45.21,13.21 50.7,13.21 IC3.21
PWM5
  Top 0.305: U2.11 37.73,24.89 39.62,24.89 43.31,21.21 43.31,19.18 45.97,16.51 48.64,16.51 49.32,15.83 IC3.17
PWM6
  Top 0.305: U2.12 39.87,25.53 43.94,21.46 43.94,19.43 46.35,17.02 48.9,17.02 49.43,16.48 IC3.16
PWM7
  Top 0.305: U2.13 40.11,26.18 44.58,21.72 44.58,19.68 46.61,17.65 49.15,17.65 49.67,17.13 IC3.15
PWM8
  Top 0.305: IC1.23 21.09,25.91 21.97,26.8 31.85,26.8 U2.15
PWM9
  Top 0.305: IC1.22 21.45,25.26 22.35,26.16 31.86,26.16 U2.16
PWM10
  Top 0.305: U2.17 22.61,25.53 21.84,24.77 21.72,24.64 21.69,24.61 IC1.21
PWM11
  Top 0.305: IC1.17 19.98,22.01 20.57,22.61 26.54,22.61 28.82,24.88 U2.18
PWM12
  Top 0.305: IC1.16 20.09,21.36 20.83,22.1 27.05,22.1 29.18,24.23 U2.19
PWM13
  Top 0.305: IC1.15 20.33,20.71 21.21,21.59 27.43,21.59 29.42,23.58 U2.20
PWM14  (via drill 0.5)
  Top 0.254: U2.21 32.96,22.93 v33.53,23.5
  Bottom 0.254: v33.53,23.5 39.12,29.08 59.18,29.08 62.36,32.26 62.36,39.24 JP1.3
PWM15  (via drill 0.5)
  Top 0.254: v33.4,22.23 33.34,22.28 U2.22
  Bottom 0.254: JP1.4 62.87,41.27 62.87,32 59.31,28.45 40.13,28.45 33.91,22.23 v33.4,22.23
SCL  (via drill 0.5)
  Top 0.305: v30.1,20.57 30.99,19.68 U2.26 v33.14,19.68 v33.15,19.68 | R8.1 17.65,45.72 18.54,46.61 18.54,46.99 JP3.1
  Bottom 0.305: U$5.SCL JP3.1 | 18.8,46.86 17.4,45.47 12.19,45.47 10.67,43.94 10.67,29.46 11.81,28.32 29.84,28.32 30.61,27.56 30.61,21.08 v30.1,20.57 | v33.15,19.68 37.85,19.68 38.73,18.8 39.37,18.8 48.9,9.27 59.56,9.27 63.5,5.33 U$5.A5
  Bottom 0.61: 18.8,46.86 JP3.1
SDA  (via drill 0.5)
  Top 0.305: 31.9,19.05 U2.27 29.99,19.03 v29.59,19.43 | JP3.2 21.34,46.86 19.05,44.58 12.19,44.58 11.3,43.69 11.3,43.18 10.18,42.05 R7.1
  Bottom 0.305: 21.34,47.12 21.34,46.48 19.43,44.58 12.19,44.58 11.3,43.69 11.3,29.84 12.19,28.96 30.1,28.96 31.24,27.81 31.24,20.07 30.61,19.43 v29.59,19.43 30.23,18.8 36.58,18.8 46.61,8.76 58.04,8.76 60.96,5.84 U$5.A4 | JP3.2 U$5.SDA
  Bottom 0.61: JP3.2 21.34,47.12
VCC  (via drill 0.5)
  Top 0.305: 24.77,18.03 v23.11,18.03 | IC1.19 17.65,23.37 17.65,23.9 IC1.20 20.87,23.96 v21.08,23.75 23.38,23.75 C2.1 | 24.77,18.41 24.77,19.05 | 24.77,19.05 24.77,20.07 C1.1 | v24.77,10.03 24.89,10.16 A0.1 A1.1 A2.1 A3.2 A4.2 | 28.57,18.8 25.02,18.8 24.77,19.05 | 28.57,18.8 28.7,18.92 28.7,20.7 29.46,21.46 30.48,21.46 30.96,20.98 U2.24 | U2.28 28.99,18.38 28.57,18.8 | 50.66,14.61 IC3.19 | IC3.20 IC3.19 | v50.04,10.16 48.64,10.16 48.24,10.16 | IC3.19 50.42,14.22 v49.28,14.22 48.37,14.22 C3.1 | R8.2 10.81,45.72 v10.74,45.65 | v10.74,45.65 10.87,45.78 | R7.2 10.16,45.07 v10.74,45.65 | C6.1 17.14,17.91 v16.76,18.29 | 48.21,10.16 48.24,10.16 | 48.24,10.16 C10.1
  Top 0.406: v24.77,10.03 24.77,18.03 24.77,18.41 | SJ1.2 36.83,10.16 A0.1
  Top 0.61: 48.64,10.16 48.64,9.22 47.93,8.51 43.43,8.51 41.78,10.16 A0.1
  Bottom 0.305: 17.02,24 20.83,24 v21.08,23.75 | 17.02,24 16.76,23.75 v16.76,18.29 17.02,18.03 v23.11,18.03 | v49.28,14.22 49.28,10.92 v50.04,10.16 | 17.02,24 15.75,25.27 15.75,27.69 11.43,27.69 10.16,28.96 10.16,45.07 v10.74,45.65
VIN
  Bottom 1.016: PWR.2 23.11,7.87 45.09,7.87 45.59,7.37 45.59,6.1 JP2.1 U$5.VIN

### Text on the board
tPlace: Servo 1 | Servo 2 | Servo pins | S1 | S2 | PWMs | #15 | #14 | #1 | Opt. servo | #0 | pwr supply | Cut | Trace | M1 | Adafruit Motor Shield v2.0 | 2 steppers | 4 DC motors | 1.2A per motor | (3A max) | GND | M4 | M2 | VIN | GND | Jumper | Power | logic: | 3v | 5v | M3 | + | - | 5-12V motor | Power